# Altium schematic sheet Schematic.SchDoc
size A2
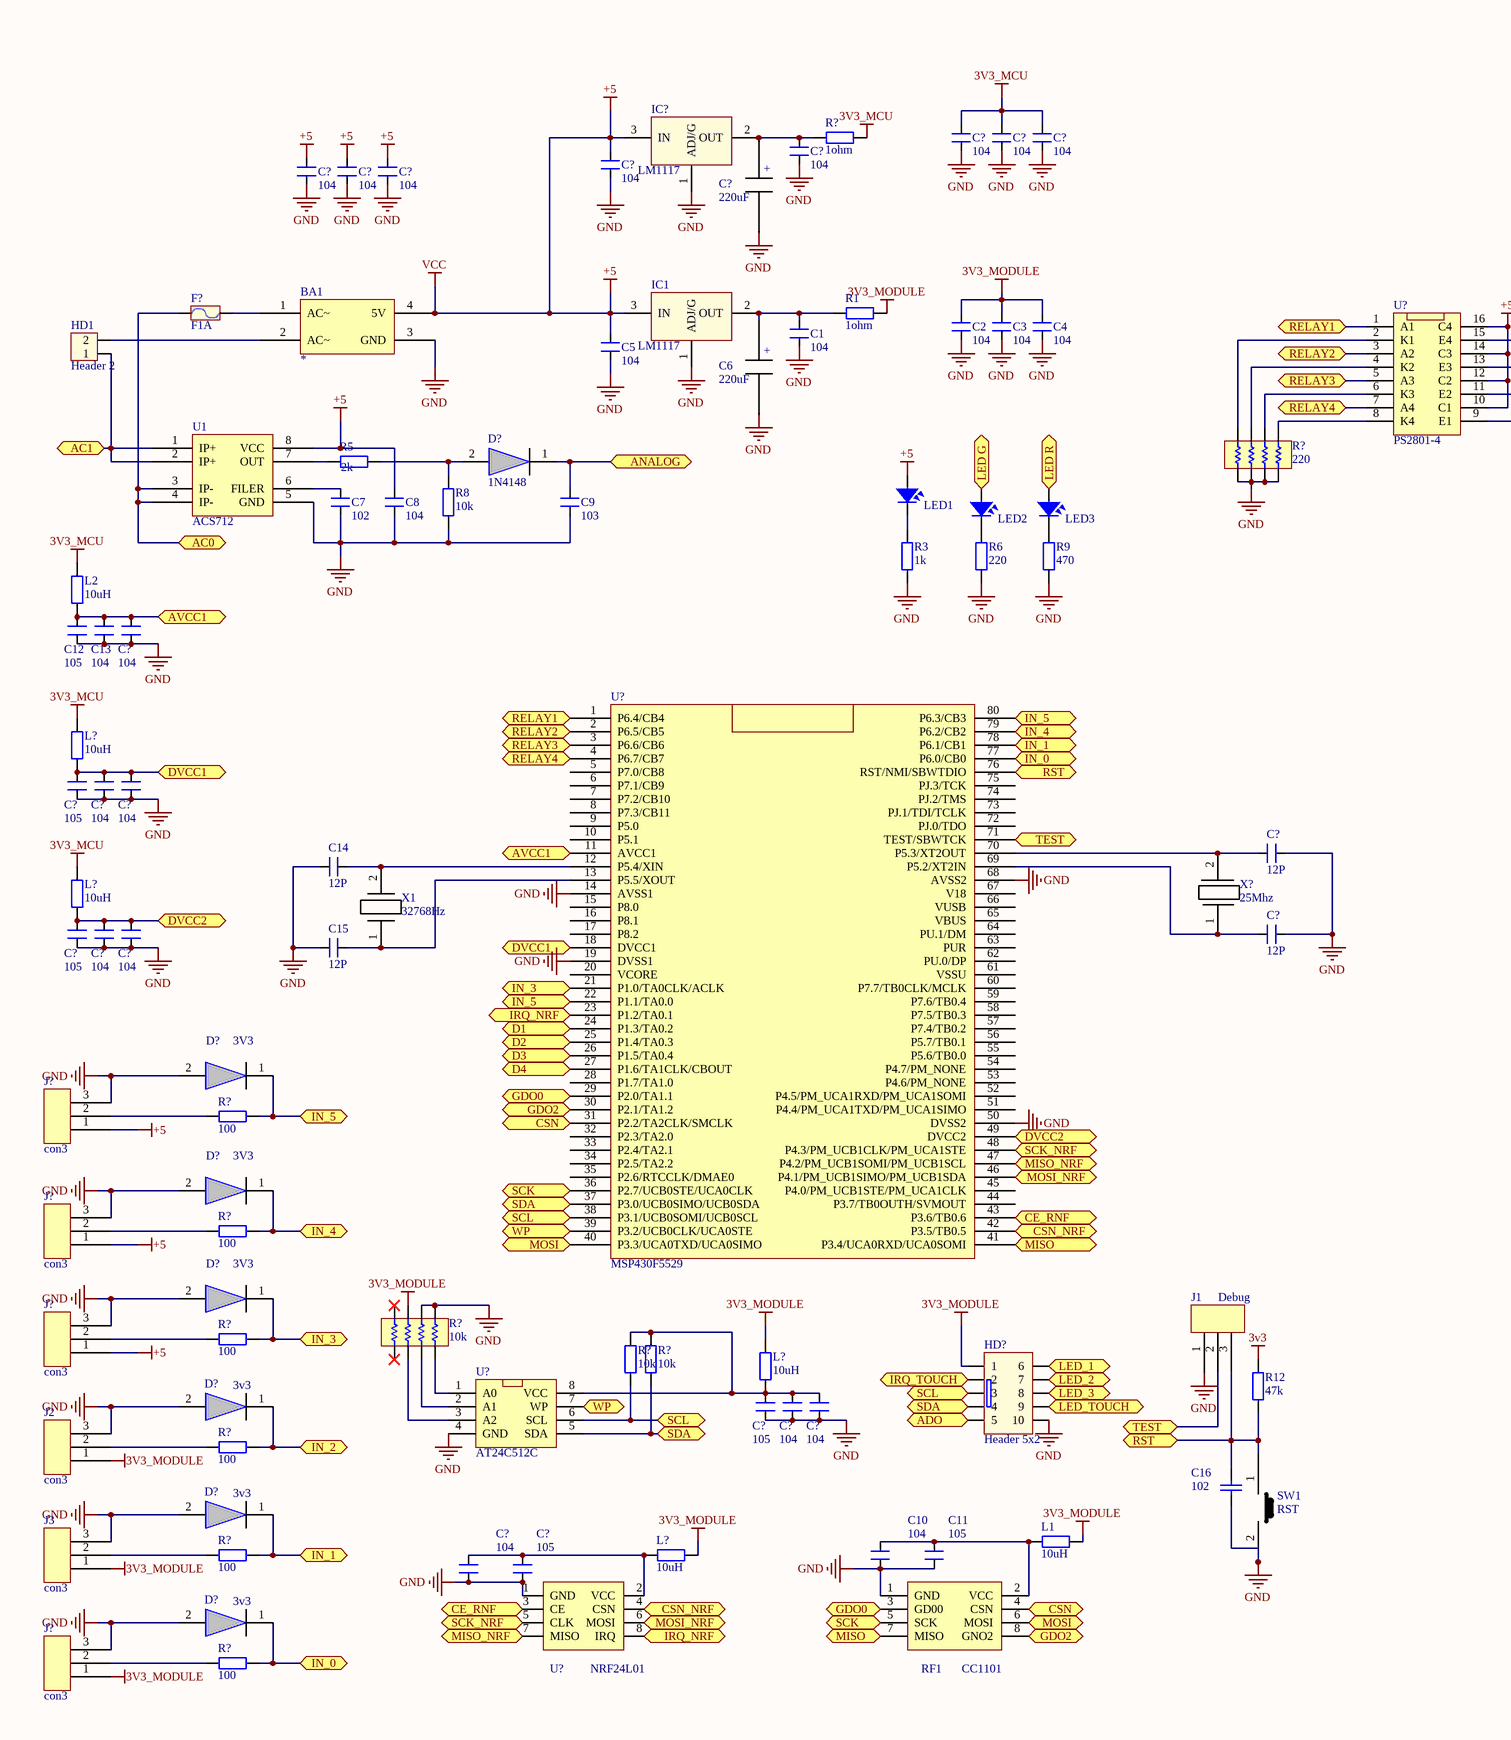
[diagram p0: Schematic.SchDoc, left]
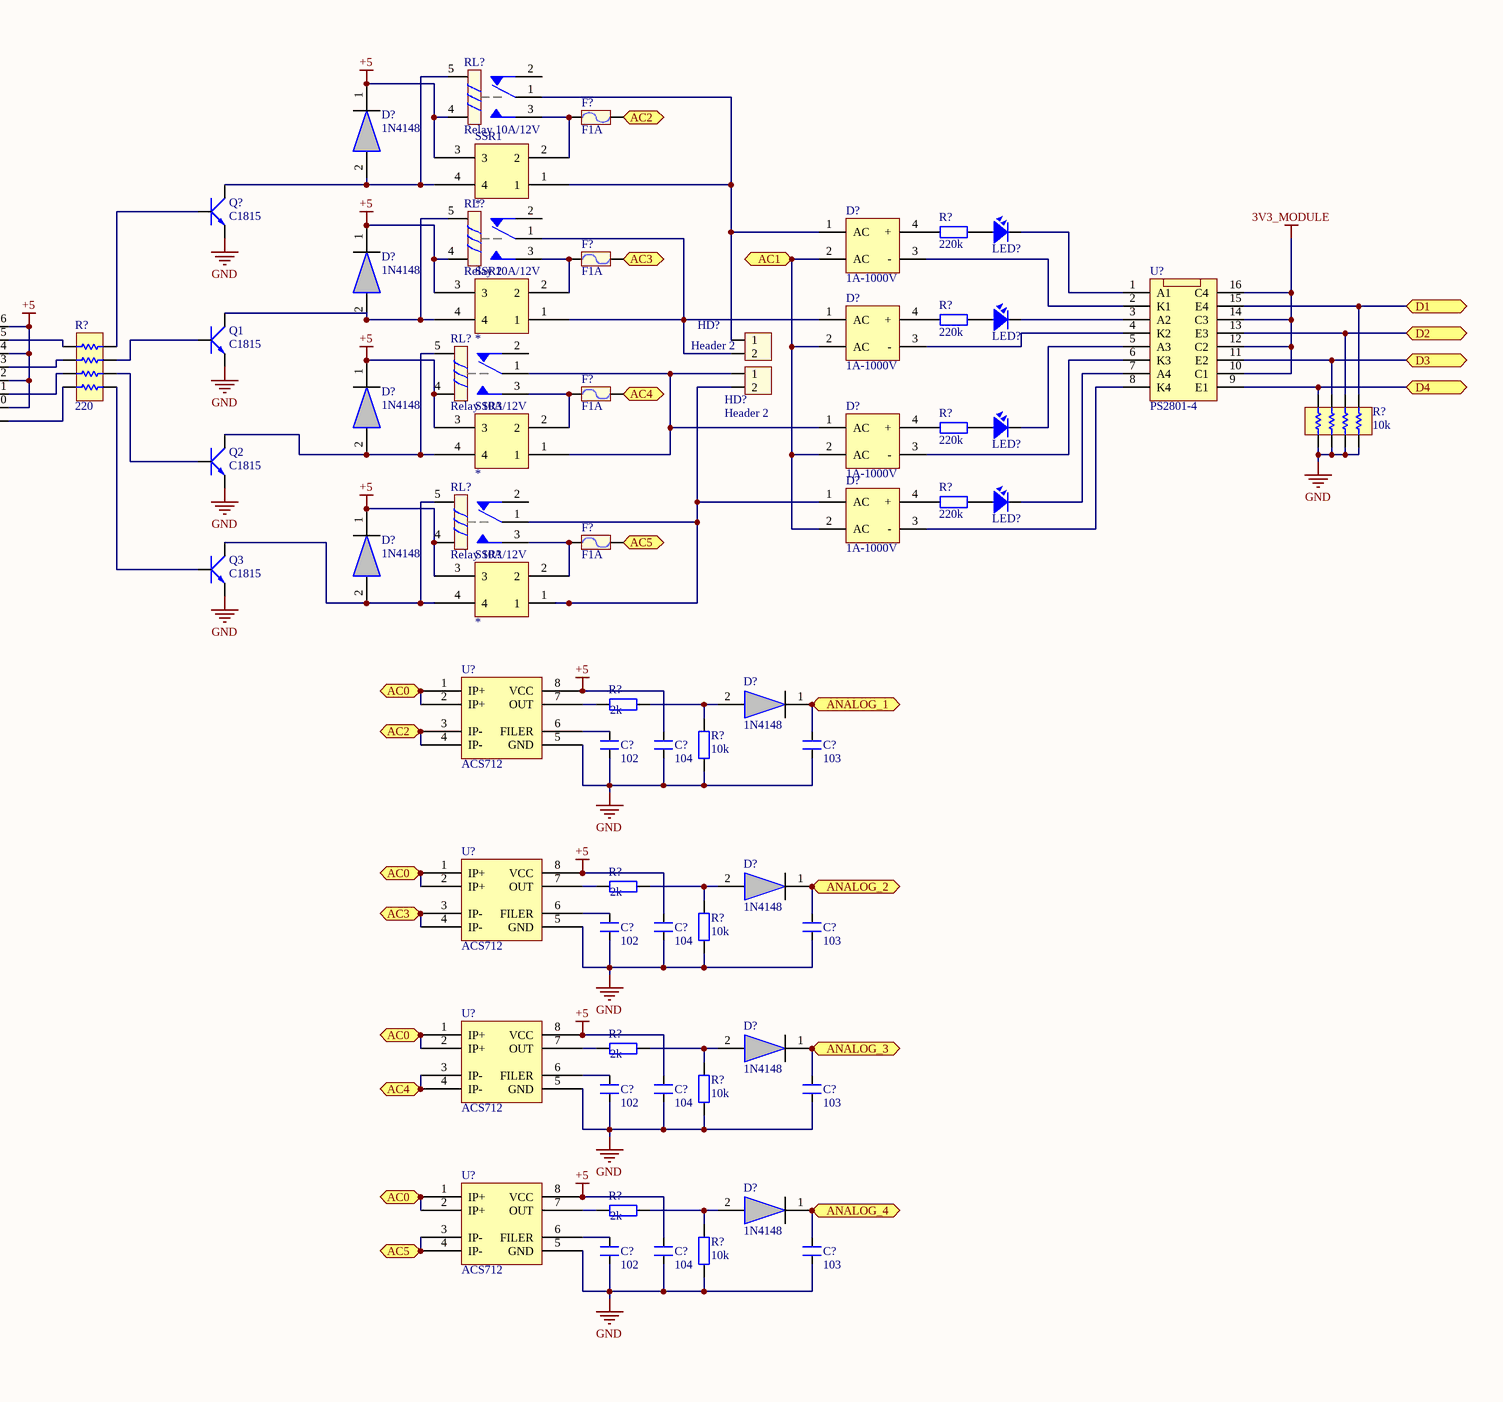
[diagram p1: Schematic.SchDoc, right]

## Parts
(Parts that share a designator on the sheet are numbered #1, #2 ... from top to bottom, then left to right.)
BA1  *  [bien ap 5V-700ma]
C1  104  [CM-0805]
C2  104  [CM-0805]
C3  104  [CM-0805]
C4  104  [CM-0805]
C5  104  [CM-0805]
C6  220uF  [CAPAE7053X54M]
C7  102  [CM-0805]
C8  104  [CM-0805]
C9  103  [CM-0805]
C10  104  [CM-0805]
C11  105  [CM-0805]
C12  105  [CM-0805]
C13  104  [CM-0805]
C14  12P  [CM-0805]
C15  12P  [CM-0805]
C16  value 102  [C0805]  (hidden comment: Capacitor Ceramic)
C?#1  104  [CM-0805]
C?#2  104  [CM-0805]
C?#3  104  [CM-0805]
C?#4  104  [CM-0805]
C?#5  104  [CM-0805]
C?#6  104  [CM-0805]
C?#7  104  [CM-0805]
C?#8  104  [CM-0805]
C?#9  220uF  [CAPAE7053X54M]
C?#10  104  [CM-0805]
C?#11  102  [CM-0805]
C?#12  104  [CM-0805]
C?#13  103  [CM-0805]
C?#14  105  [CM-0805]
C?#15  104  [CM-0805]
C?#16  104  [CM-0805]
C?#17  12P  [CM-0805]
C?#18  102  [CM-0805]
C?#19  104  [CM-0805]
C?#20  103  [CM-0805]
C?#21  105  [CM-0805]
C?#22  104  [CM-0805]
C?#23  104  [CM-0805]
C?#24  12P  [CM-0805]
C?#25  102  [CM-0805]
C?#26  104  [CM-0805]
C?#27  103  [CM-0805]
C?#28  102  [CM-0805]
C?#29  104  [CM-0805]
C?#30  103  [CM-0805]
C?#31  105  [CM-0805]
C?#32  104  [CM-0805]
C?#33  104  [CM-0805]
C?#34  104  [CM-0805]
C?#35  105  [CM-0805]
D?#1  1N4148  [DIOMELF3615N]
D?#2  1N4148  [DIOMELF3615N]
D?#3  1A-1000V  [SOT510P1015X340-4N]
D?#4  1N4148  [DIOMELF3615N]
D?#5  1A-1000V  [SOT510P1015X340-4N]
D?#6  1N4148  [DIOMELF3615N]
D?#7  1A-1000V  [SOT510P1015X340-4N]
D?#8  1N4148  [DIOMELF3615N]
D?#9  1A-1000V  [SOT510P1015X340-4N]
D?#10  1N4148  [DIOMELF3615N]
D?#11  1N4148  [DIOMELF3615N]
D?#12  1N4148  [DIOMELF3615N]
D?#13  3V3  [DIOMELF3615N]
D?#14  3V3  [DIOMELF3615N]
D?#15  1N4148  [DIOMELF3615N]
D?#16  3V3  [DIOMELF3615N]
D?#17  3v3  [DIOMELF3615N]
D?#18  3v3  [DIOMELF3615N]
D?#19  3v3  [DIOMELF3615N]
F?#1  F1A  [Fuse]
F?#2  F1A  [Fuse]
F?#3  F1A  [Fuse]
F?#4  F1A  [Fuse]
F?#5  F1A  [Fuse]
HD1  Header 2  [HED2]
HD?#1  Header 2  [HED2]
HD?#2  Header 2  [HED2]
HD?#3  Header 5x2  [Hed2X5]
IC1  LM1117  [SOT223-4N]
IC?  LM1117  [SOT223-4N]
J1  Debug  [Con3]
J2  con3  [Con3]
J3  con3  [Con3]
J?#1  con3  [Con3]
J?#2  con3  [Con3]
J?#3  con3  [Con3]
J?#4  con3  [Con3]
L1  10uH  [SM-RES-0805]
L2  10uH  [SM-RES-0805]
L?#1  10uH  [SM-RES-0805]
L?#2  10uH  [SM-RES-0805]
L?#3  10uH  [SM-RES-0805]
L?#4  10uH  [SM-RES-0805]
LED1  LED  [LED-3]  (value not drawn)
LED2  LED  [LED-3]  (value not drawn)
LED3  LED  [LED-3]  (value not drawn)
LED?#1  LED SMD  [SM-LED-0805-Red]  (value not drawn)
LED?#2  LED SMD  [SM-LED-0805-Red]  (value not drawn)
LED?#3  LED SMD  [SM-LED-0805-Red]  (value not drawn)
LED?#4  LED SMD  [SM-LED-0805-Red]  (value not drawn)
Q1  C1815  [SOT23B]
Q2  C1815  [SOT23B]
Q3  C1815  [SOT23B]
Q?  C1815  [SOT23B]
R1  1ohm  [SM-RES-0805]
R3  1k  [SM-RES-0805]
R5  2k  [SM-RES-0805]
R6  220  [SM-RES-0805]
R8  10k  [SM-RES-0805]
R9  470  [SM-RES-0805]
R12  47k  [SM-RES-0805]
R?#1  1ohm  [SM-RES-0805]
R?#2  220k  [SM-RES-0805]
R?#3  220k  [SM-RES-0805]
R?#4  220  [CAC-80P319X159-8N]
R?#5  10k  [CAC-80P319X159-8N]
R?#6  220k  [SM-RES-0805]
R?#7  220  [CAC-80P319X159-8N]
R?#8  220k  [SM-RES-0805]
R?#9  2k  [SM-RES-0805]
R?#10  10k  [SM-RES-0805]
R?#11  2k  [SM-RES-0805]
R?#12  10k  [SM-RES-0805]
R?#13  2k  [SM-RES-0805]
R?#14  10k  [SM-RES-0805]
R?#15  100  [SM-RES-0805]
R?#16  2k  [SM-RES-0805]
R?#17  100  [SM-RES-0805]
R?#18  10k  [SM-RES-0805]
R?#19  10k  [CAC-80P319X159-8N]
R?#20  100  [SM-RES-0805]
R?#21  10k  [SM-RES-0805]
R?#22  10k  [SM-RES-0805]
R?#23  100  [SM-RES-0805]
R?#24  100  [SM-RES-0805]
R?#25  100  [SM-RES-0805]
RF1  CC1101  [CC1101 - duplicate1]
RL?#1  Relay 10A/12V  [RL_SPDT_10A]
RL?#2  Relay 10A/12V  [RL_SPDT_10A]
RL?#3  Relay 10A/12V  [RL_SPDT_10A]
RL?#4  Relay 10A/12V  [RL_SPDT_10A]
SSR1  *  [OMRON g3mb]
SSR2  *  [OMRON g3mb]
SSR3  *  [OMRON g3mb]
SSR?  *  [OMRON g3mb]
SW1  RST  [BUTTON]
U1  ACS712  [SOIC127P600X265-8N]
U?#1  PS2801-4  [Opto_PS2801-4]
U?#2  PS2801-4  [Opto_PS2801-4]
U?#3  ACS712  [SOIC127P600X265-8N]
U?#4  ACS712  [SOIC127P600X265-8N]
U?#5  MSP430F5529  [SQFP50P1400X1400X245-80N]
U?#6  ACS712  [SOIC127P600X265-8N]
U?#7  ACS712  [SOIC127P600X265-8N]
U?#8  AT24C512C  [TSOP65P640X120-8N]
U?#9  NRF24L01  [NRF24L01]
X1  32768Hz  [32768hz]
X?  25Mhz  [CAPAE13443X63M]

## Ports
AC0, AC1, AC2, AC3, AC4, AC5, ADO, ANALOG, ANALOG_1, ANALOG_2, ANALOG_3, ANALOG_4, AVCC1, CE_RNF, CSN, CSN_NRF, D1, D2, D3, D4, DVCC1, DVCC2, GDO0, GDO2, IN_0, IN_1, IN_2, IN_3, IN_4, IN_5, IRQ_NRF, IRQ_TOUCH, LED G, LED R, LED_1, LED_2, LED_3, LED_TOUCH, MISO, MISO_NRF, MOSI, MOSI_NRF, RELAY1, RELAY2, RELAY3, RELAY4, RST, SCK, SCK_NRF, SCL, SDA, TEST, WP

## Nets
3v3: R12.1
3V3_MCU: C?#1.2 C?#2.2 C?#3.2 L2.2 L?#1.2 L?#2.2 R?#1.1
3V3_MODULE: C2.2 C3.2 C4.2 HD?#3.1 J2.1 J3.1 J?#4.1 L1.2 L?#3.2 L?#4.2 R1.1 R?#19.3 U?#1.10(C1) U?#1.12(C2) U?#1.14(C3) U?#1.16(C4)
+5: BA1.4(5V) C5.2 C8.2 C?#5.2 C?#6.2 C?#7.2 C?#8.2 C?#12.2 C?#19.2 C?#26.2 C?#29.2 D?#1.1 D?#2.1 D?#4.1 D?#8.1 IC1.3(IN) IC?.3(IN) J?#1.1 J?#2.1 J?#3.1 LED1.1 RL?#1.4 RL?#2.4 RL?#3.4 RL?#4.4 SSR1.3 SSR2.3 SSR3.3 SSR?.3 U1.8(VCC) U?#2.10(C1) U?#2.12(C2) U?#2.14(C3) U?#2.16(C4) U?#3.8(VCC) U?#4.8(VCC) U?#6.8(VCC) U?#7.8(VCC)  [also labelled VCC]
GND: BA1.3(GND) C1.1 C2.1 C3.1 C4.1 C5.1 C6.2 C7.1 C8.1 C9.1 C10.1 C11.1 C12.1 C13.1 C14.2 C15.2 C16.1 C?#1.1 C?#2.1 C?#3.1 C?#4.1 C?#5.1 C?#6.1 C?#7.1 C?#8.1 C?#9.2 C?#10.1 C?#11.1 C?#12.1 C?#13.1 C?#14.1 C?#15.1 C?#16.1 C?#17.1 C?#18.1 C?#19.1 C?#20.1 C?#21.1 C?#22.1 C?#23.1 C?#24.1 C?#25.1 C?#26.1 C?#27.1 C?#28.1 C?#29.1 C?#30.1 C?#31.1 C?#32.1 C?#33.1 C?#34.1 C?#35.1 D?#13.2 D?#14.2 D?#16.2 D?#17.2 D?#18.2 D?#19.2 HD?#3.10 IC1.1(ADJ/G) IC?.1(ADJ/G) J1.1 J2.3 J3.3 J?#1.3 J?#2.3 J?#3.3 J?#4.3 Q1.1(E) Q2.1(E) Q3.1(E) Q?.1(E) R3.1 R6.2 R8.1 R9.2 R?#5.5 R?#5.6 R?#5.7 R?#5.8 R?#7.5 R?#7.6 R?#7.7 R?#7.8 R?#10.1 R?#12.1 R?#14.1 R?#18.1 R?#19.1 R?#19.2 RF1.1(GND) SW1.2 U1.5(GND) U?#3.5(GND) U?#4.5(GND) U?#5.14(AVSS1) U?#5.19(DVSS1) U?#5.50(DVSS2) U?#5.68(AVSS2) U?#6.5(GND) U?#7.5(GND) U?#8.4(GND) U?#9.1(GND)
AC0: F?#3.1 U1.3(IP-) U1.4(IP-) U?#3.1(IP+) U?#3.2(IP+) U?#4.1(IP+) U?#4.2(IP+) U?#6.1(IP+) U?#6.2(IP+) U?#7.1(IP+) U?#7.2(IP+) ; port AC0
AC1: D?#3.2(AC) D?#5.2(AC) D?#7.2(AC) D?#9.2(AC) HD1.1 U1.1(IP+) U1.2(IP+) ; port AC1
AC2: F?#1.2 U?#3.3(IP-) U?#3.4(IP-) ; port AC2
AC3: F?#2.2 U?#4.3(IP-) U?#4.4(IP-) ; port AC3
AC4: F?#4.2 U?#6.3(IP-) U?#6.4(IP-) ; port AC4
AC5: F?#5.2 U?#7.3(IP-) U?#7.4(IP-) ; port AC5
ADO: HD?#3.5 ; port ADO
ANALOG: C9.2 D?#6.1 ; port ANALOG
ANALOG_1: C?#13.2 D?#10.1 ; port ANALOG_1
ANALOG_2: C?#20.2 D?#11.1 ; port ANALOG_2
ANALOG_3: C?#27.2 D?#12.1 ; port ANALOG_3
ANALOG_4: C?#30.2 D?#15.1 ; port ANALOG_4
AVCC1: C12.2 C13.2 C?#10.2 L2.1 U?#5.11(AVCC1) ; port AVCC1
CE_RNF: U?#5.43(P3.6/TB0.6) U?#9.3(CE) ; port CE_RNF
CSN: RF1.4(CSN) U?#5.31(P2.2/TA2CLK/SMCLK) ; port CSN
CSN_NRF: U?#5.42(P3.5/TB0.5) U?#9.4(CSN) ; port CSN_NRF
D1: R?#5.1 U?#1.15(E4) U?#5.24(P1.3/TA0.2) ; port D1
D2: R?#5.2 U?#1.13(E3) U?#5.25(P1.4/TA0.3) ; port D2
D3: R?#5.3 U?#1.11(E2) U?#5.26(P1.5/TA0.4) ; port D3
D4: R?#5.4 U?#1.9(E1) U?#5.27(P1.6/TA1CLK/CBOUT) ; port D4
DVCC1: C?#14.2 C?#15.2 C?#16.2 L?#1.1 U?#5.18(DVCC1) ; port DVCC1
DVCC2: C?#21.2 C?#22.2 C?#23.2 L?#2.1 U?#5.49(DVCC2) ; port DVCC2
GDO0: RF1.3(GD00) U?#5.29(P2.0/TA1.1) ; port GDO0
GDO2: RF1.8(GNO2) U?#5.30(P2.1/TA1.2) ; port GDO2
IN_0: D?#19.1 R?#25.1 U?#5.77(P6.0/CB0) ; port IN_0
IN_1: D?#18.1 R?#24.1 U?#5.78(P6.1/CB1) ; port IN_1
IN_2: D?#17.1 R?#23.1 ; port IN_2
IN_3: D?#16.1 R?#20.1 U?#5.21(P1.0/TA0CLK/ACLK) ; port IN_3
IN_4: D?#14.1 R?#17.1 U?#5.79(P6.2/CB2) ; port IN_4
IN_5: D?#13.1 R?#15.1 U?#5.22(P1.1/TA0.0) U?#5.80(P6.3/CB3) ; port IN_5
IRQ_NRF: U?#5.23(P1.2/TA0.1) U?#9.8(IRQ) ; port IRQ_NRF
IRQ_TOUCH: HD?#3.2 ; port IRQ_TOUCH
LED G: LED2.1 ; port LED G
LED R: LED3.1 ; port LED R
LED_1: HD?#3.6 ; port LED_1
LED_2: HD?#3.7 ; port LED_2
LED_3: HD?#3.8 ; port LED_3
LED_TOUCH: HD?#3.9 ; port LED_TOUCH
MISO: RF1.7(MISO) U?#5.41(P3.4/UCA0RXD/UCA0SOMI) ; port MISO
MISO_NRF: U?#5.47(P4.2/PM_UCB1SOMI/PM_UCB1SCL) U?#9.7(MISO) ; port MISO_NRF
MOSI: RF1.6(MOSI) U?#5.40(P3.3/UCA0TXD/UCA0SIMO) ; port MOSI
MOSI_NRF: U?#5.46(P4.1/PM_UCB1SIMO/PM_UCB1SDA) U?#9.6(MOSI) ; port MOSI_NRF
RELAY1: U?#2.1(A1) U?#5.1(P6.4/CB4) ; port RELAY1
RELAY2: U?#2.3(A2) U?#5.2(P6.5/CB5) ; port RELAY2
RELAY3: U?#2.5(A3) U?#5.3(P6.6/CB6) ; port RELAY3
RELAY4: U?#2.7(A4) U?#5.4(P6.7/CB7) ; port RELAY4
RST: C16.2 J1.3 R12.2 SW1.1 U?#5.76(RST/NMI/SBWTDIO) ; port RST
SCK: RF1.5(SCK) U?#5.36(P2.7/UCB0STE/UCA0CLK) ; port SCK
SCK_NRF: U?#5.48(P4.3/PM_UCB1CLK/PM_UCA1STE) U?#9.5(CLK) ; port SCK_NRF
SCL: HD?#3.3 R?#21.2 U?#5.38(P3.1/UCB0SOMI/UCB0SCL) U?#8.6(SCL) ; port SCL
SDA: HD?#3.4 R?#22.2 U?#5.37(P3.0/UCB0SIMO/UCB0SDA) U?#8.5(SDA) ; port SDA
TEST: J1.2 U?#5.71(TEST/SBWTCK) ; port TEST
WP: U?#5.39(P3.2/UCB0CLK/UCA0STE) U?#8.7(WP) ; port WP
NetBA1_1: BA1.1(AC~) F?#3.2
NetBA1_2: BA1.2(AC~) HD1.2
NetC1_2: C1.2 C6.1 IC1.2(OUT) R1.2
NetC7_2: C7.2 U1.6(FILER)
NetC10_2: C10.2 C11.2 L1.1 RF1.2(VCC)
NetC14_1: C14.1 U?#5.12(P5.4/XIN) X1.2
NetC15_1: C15.1 U?#5.13(P5.5/XOUT) X1.1
NetC?#4_2: C?#4.2 C?#9.1 IC?.2(OUT) R?#1.2
NetC?#11_2: C?#11.2 U?#3.6(FILER)
NetC?#17_2: C?#17.2 U?#5.70(P5.3/XT2OUT) X?.2(XOUT)
NetC?#18_2: C?#18.2 U?#4.6(FILER)
NetC?#24_2: C?#24.2 U?#5.69(P5.2/XT2IN) X?.1(XIN)
NetC?#25_2: C?#25.2 U?#6.6(FILER)
NetC?#28_2: C?#28.2 U?#7.6(FILER)
NetC?#31_2: C?#31.2 C?#32.2 C?#33.2 L?#3.1 R?#21.1 R?#22.1 U?#8.8(VCC)
NetC?#34_2: C?#34.2 C?#35.2 L?#4.1 U?#9.2(VCC)
NetD?#1_2: D?#1.2 Q?.2(C) RL?#1.5 SSR1.4
NetD?#2_2: D?#2.2 Q1.2(C) RL?#2.5 SSR2.4
NetD?#3_1: D?#3.1(AC) HD?#1.1 RL?#1.1 SSR1.1
NetD?#3_3: D?#3.3(-) U?#1.2(K1)
NetD?#3_4: D?#3.4(+) R?#2.1
NetD?#4_2: D?#4.2 Q2.2(C) RL?#3.5 SSR3.4
NetD?#5_1: D?#5.1(AC) HD?#1.2 RL?#2.1 SSR2.1
NetD?#5_3: D?#5.3(-) U?#1.4(K2)
NetD?#5_4: D?#5.4(+) R?#3.1
NetD?#6_2: D?#6.2 R5.2 R8.2
NetD?#7_1: D?#7.1(AC) HD?#2.1 RL?#3.1 SSR3.1
NetD?#7_3: D?#7.3(-) U?#1.6(K3)
NetD?#7_4: D?#7.4(+) R?#6.1
NetD?#8_2: D?#8.2 Q3.2(C) RL?#4.5 SSR?.4
NetD?#9_1: D?#9.1(AC) HD?#2.2 RL?#4.1 SSR?.1
NetD?#9_3: D?#9.3(-) U?#1.8(K4)
NetD?#9_4: D?#9.4(+) R?#8.1
NetD?#10_2: D?#10.2 R?#9.2 R?#10.2
NetD?#11_2: D?#11.2 R?#11.2 R?#12.2
NetD?#12_2: D?#12.2 R?#13.2 R?#14.2
NetD?#15_2: D?#15.2 R?#16.2 R?#18.2
NetF?#1_1: F?#1.1 RL?#1.3 SSR1.2
NetF?#2_1: F?#2.1 RL?#2.3 SSR2.2
NetF?#4_1: F?#4.1 RL?#3.3 SSR3.2
NetF?#5_1: F?#5.1 RL?#4.3 SSR?.2
NetJ2_2: J2.2 R?#23.2
NetJ3_2: J3.2 R?#24.2
NetJ?#1_2: J?#1.2 R?#15.2
NetJ?#2_2: J?#2.2 R?#17.2
NetJ?#3_2: J?#3.2 R?#20.2
NetJ?#4_2: J?#4.2 R?#25.2
NetLED1_2: LED1.2 R3.2
NetLED2_2: LED2.2 R6.1
NetLED3_2: LED3.2 R9.1
NetLED?#1_1: LED?#1.1 R?#2.2
NetLED?#1_2: LED?#1.2 U?#1.1(A1)
NetLED?#2_1: LED?#2.1 R?#3.2
NetLED?#2_2: LED?#2.2 U?#1.3(A2)
NetLED?#3_1: LED?#3.1 R?#6.2
NetLED?#3_2: LED?#3.2 U?#1.5(A3)
NetLED?#4_1: LED?#4.1 R?#8.2
NetLED?#4_2: LED?#4.2 U?#1.7(A4)
NetQ1_3: Q1.3(B) R?#4.7
NetQ2_3: Q2.3(B) R?#4.6
NetQ3_3: Q3.3(B) R?#4.5
NetQ?_3: Q?.3(B) R?#4.8
NetR5_1: R5.1 U1.7(OUT)
NetR?#4_1: R?#4.1 U?#2.15(E4)
NetR?#4_2: R?#4.2 U?#2.13(E3)
NetR?#4_3: R?#4.3 U?#2.11(E2)
NetR?#4_4: R?#4.4 U?#2.9(E1)
NetR?#7_1: R?#7.1 U?#2.8(K4)
NetR?#7_2: R?#7.2 U?#2.6(K3)
NetR?#7_3: R?#7.3 U?#2.4(K2)
NetR?#7_4: R?#7.4 U?#2.2(K1)
NetR?#9_1: R?#9.1 U?#3.7(OUT)
NetR?#11_1: R?#11.1 U?#4.7(OUT)
NetR?#13_1: R?#13.1 U?#6.7(OUT)
NetR?#16_1: R?#16.1 U?#7.7(OUT)
NetR?#19_6: R?#19.6 U?#8.3(A2)
NetR?#19_7: R?#19.7 U?#8.2(A1)
NetR?#19_8: R?#19.8 U?#8.1(A0)

Not connected (* = marked no-connect by the designer): R?#19 4* 5*; RL?#1 2; RL?#2 2; RL?#3 2; RL?#4 2; U?#5 5(P7.0/CB8) 6(P7.1/CB9) 7(P7.2/CB10) 8(P7.3/CB11) 9(P5.0) 10(P5.1) 15(P8.0) 16(P8.1) 17(P8.2) 20(VCORE) 28(P1.7/TA1.0) 32(P2.3/TA2.0) 33(P2.4/TA2.1) 34(P2.5/TA2.2) 35(P2.6/RTCCLK/DMAE0) 44(P3.7/TB0OUTH/SVMOUT) 45(P4.0/PM_UCB1STE/PM_UCA1CLK) 51(P4.4/PM_UCA1TXD/PM_UCA1SIMO) 52(P4.5/PM_UCA1RXD/PM_UCA1SOMI) 53(P4.6/PM_NONE) 54(P4.7/PM_NONE) 55(P5.6/TB0.0) 56(P5.7/TB0.1) 57(P7.4/TB0.2) 58(P7.5/TB0.3) 59(P7.6/TB0.4) 60(P7.7/TB0CLK/MCLK) 61(VSSU) 62(PU.0/DP) 63(PUR) 64(PU.1/DM) 65(VBUS) 66(VUSB) 67(V18) 72(PJ.0/TDO) 73(PJ.1/TDI/TCLK) 74(PJ.2/TMS) 75(PJ.3/TCK)

## Notes on the sheet
- (in symbol Component_1) +

## Library data of the parts
BA1 C6 C?#9 D?#1 D?#2 D?#4 D?#6 D?#8 D?#10-D?#19 SSR1-SSR3 SSR? SW1 = Component_1
C1-C5 C7 C8 C10-C15 C?#1-C?#8 C?#10-C?#12 C?#14-C?#19 C?#21-C?#26 C?#28 C?#29 C?#31-C?#35 = CM: Cap SMD; Value: 103
C9 C?#13 C?#20 C?#27 C?#30 = CM: Cap SMD; Value: 103
C16 = CapSMD: Capacitor; Published: 8-Jun-2000; LatestRevisionDate: 17-Jul-2002; LatestRevisionNote: Re-released for DXP Platform.; PackageReference: RAD-0.3; Publisher: Altium Limited
D?#3 D?#5 D?#7 D?#9 = Diode bridge 1A 1000V
F?#1-F?#5 = Fuse: Designed by: VanDungEvn; Value: Fuse
HD1 HD?#1 HD?#2 = Hed2: Header 2 (Green); Value: Header 2
HD?#3 = HED5x2: Value: Header 5x2
IC1 IC? = LM1117: Available in 1.8V, 2.5V, 2.85V, 3.3V, 5V, and  Adjustable Versions; Value: LM317
J1 = con3
L1 L2 L?#1-L?#4 R1 R3 R5 R6 R8 R9 R12 R?#1-R?#3 R?#6 R?#8-R?#18 R?#20-R?#25 = R1/4W: Resistor 1/4W; Value: R1/4W - 1K
LED1-LED3 = LED: LED Single colour Green and Red; Value: LED 3 ly Single Colour
LED?#1-LED?#4 = LED-SMD-0805
Q1-Q3 Q? = C1815: NPN 600mW, ECB; Value: C1815
R?#4 R?#5 R?#7 R?#19 = Resistor
RL?#1-RL?#4 = Relay 1: Relay SPDT,10A - 12VDC 5 Pin; Value: Relay SPDT, 10A, 12V
U?#1 U?#2 = PS2801-4: opto
U?#8 = AT24C512C: EEPROM
U?#9 = Module NRF24L01+
X? = 25MHz-HC49S SMD